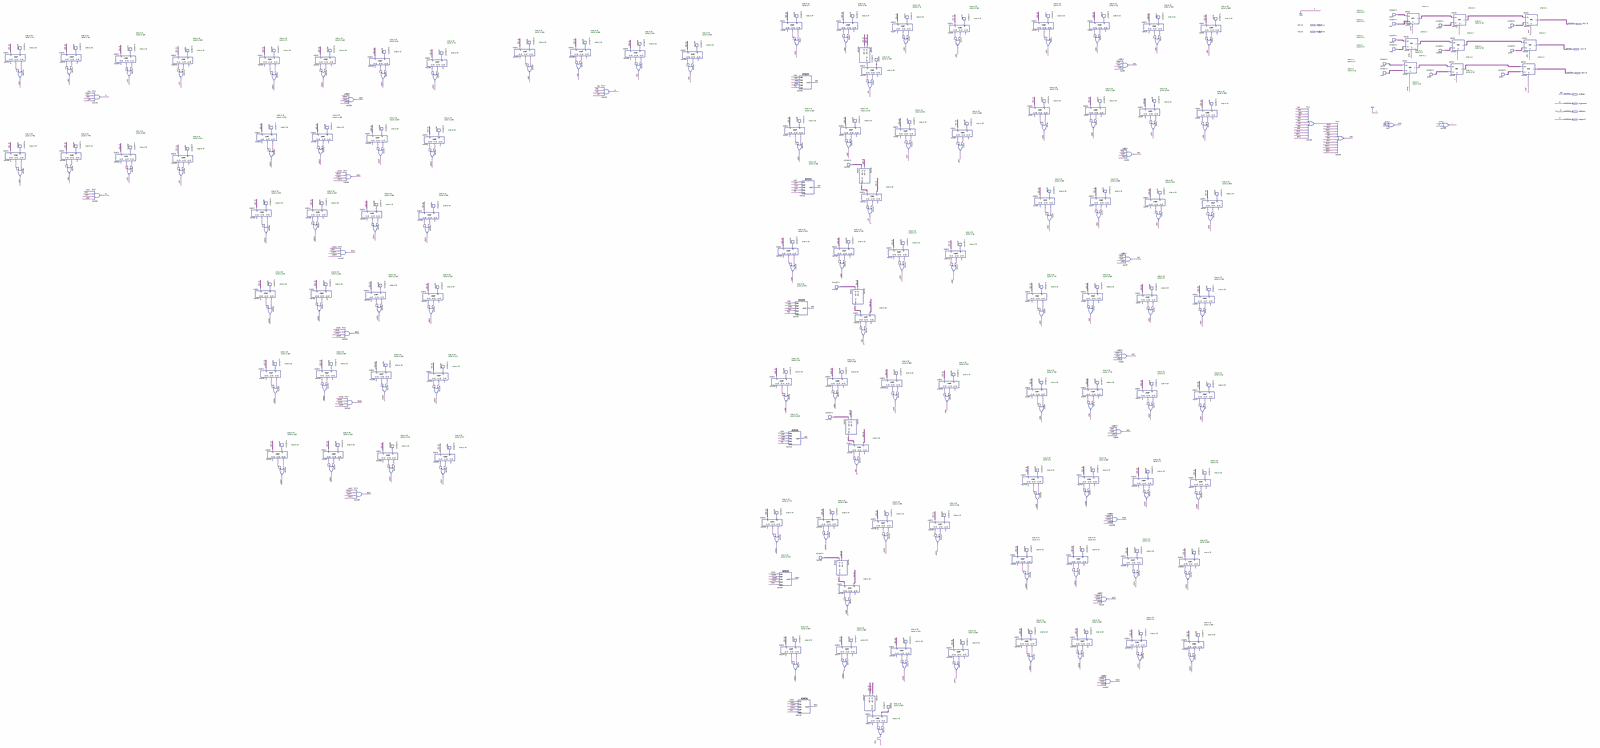
[diagram p0: schematic sheet, whole]
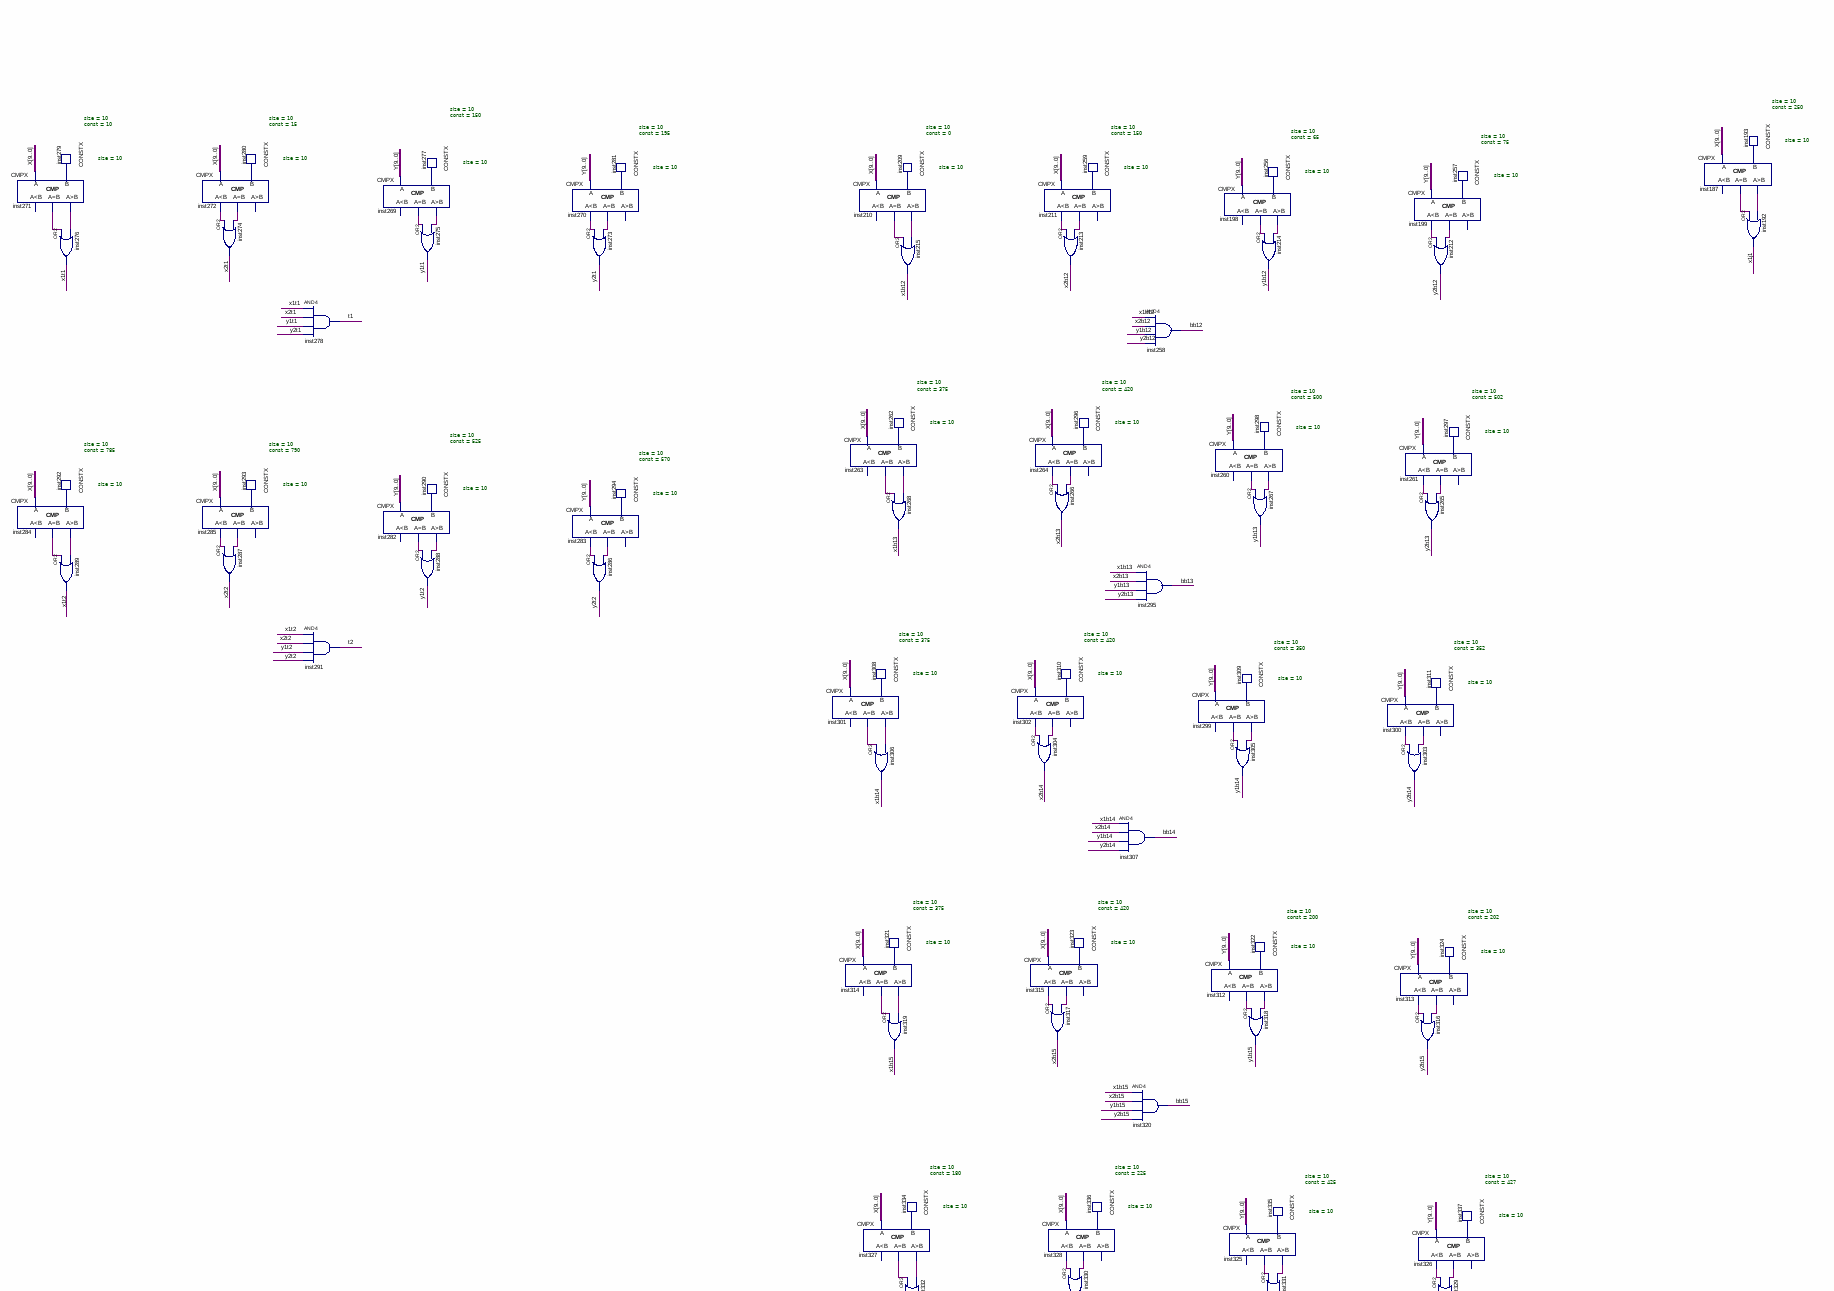
[diagram p1: schematic sheet, upper left part]
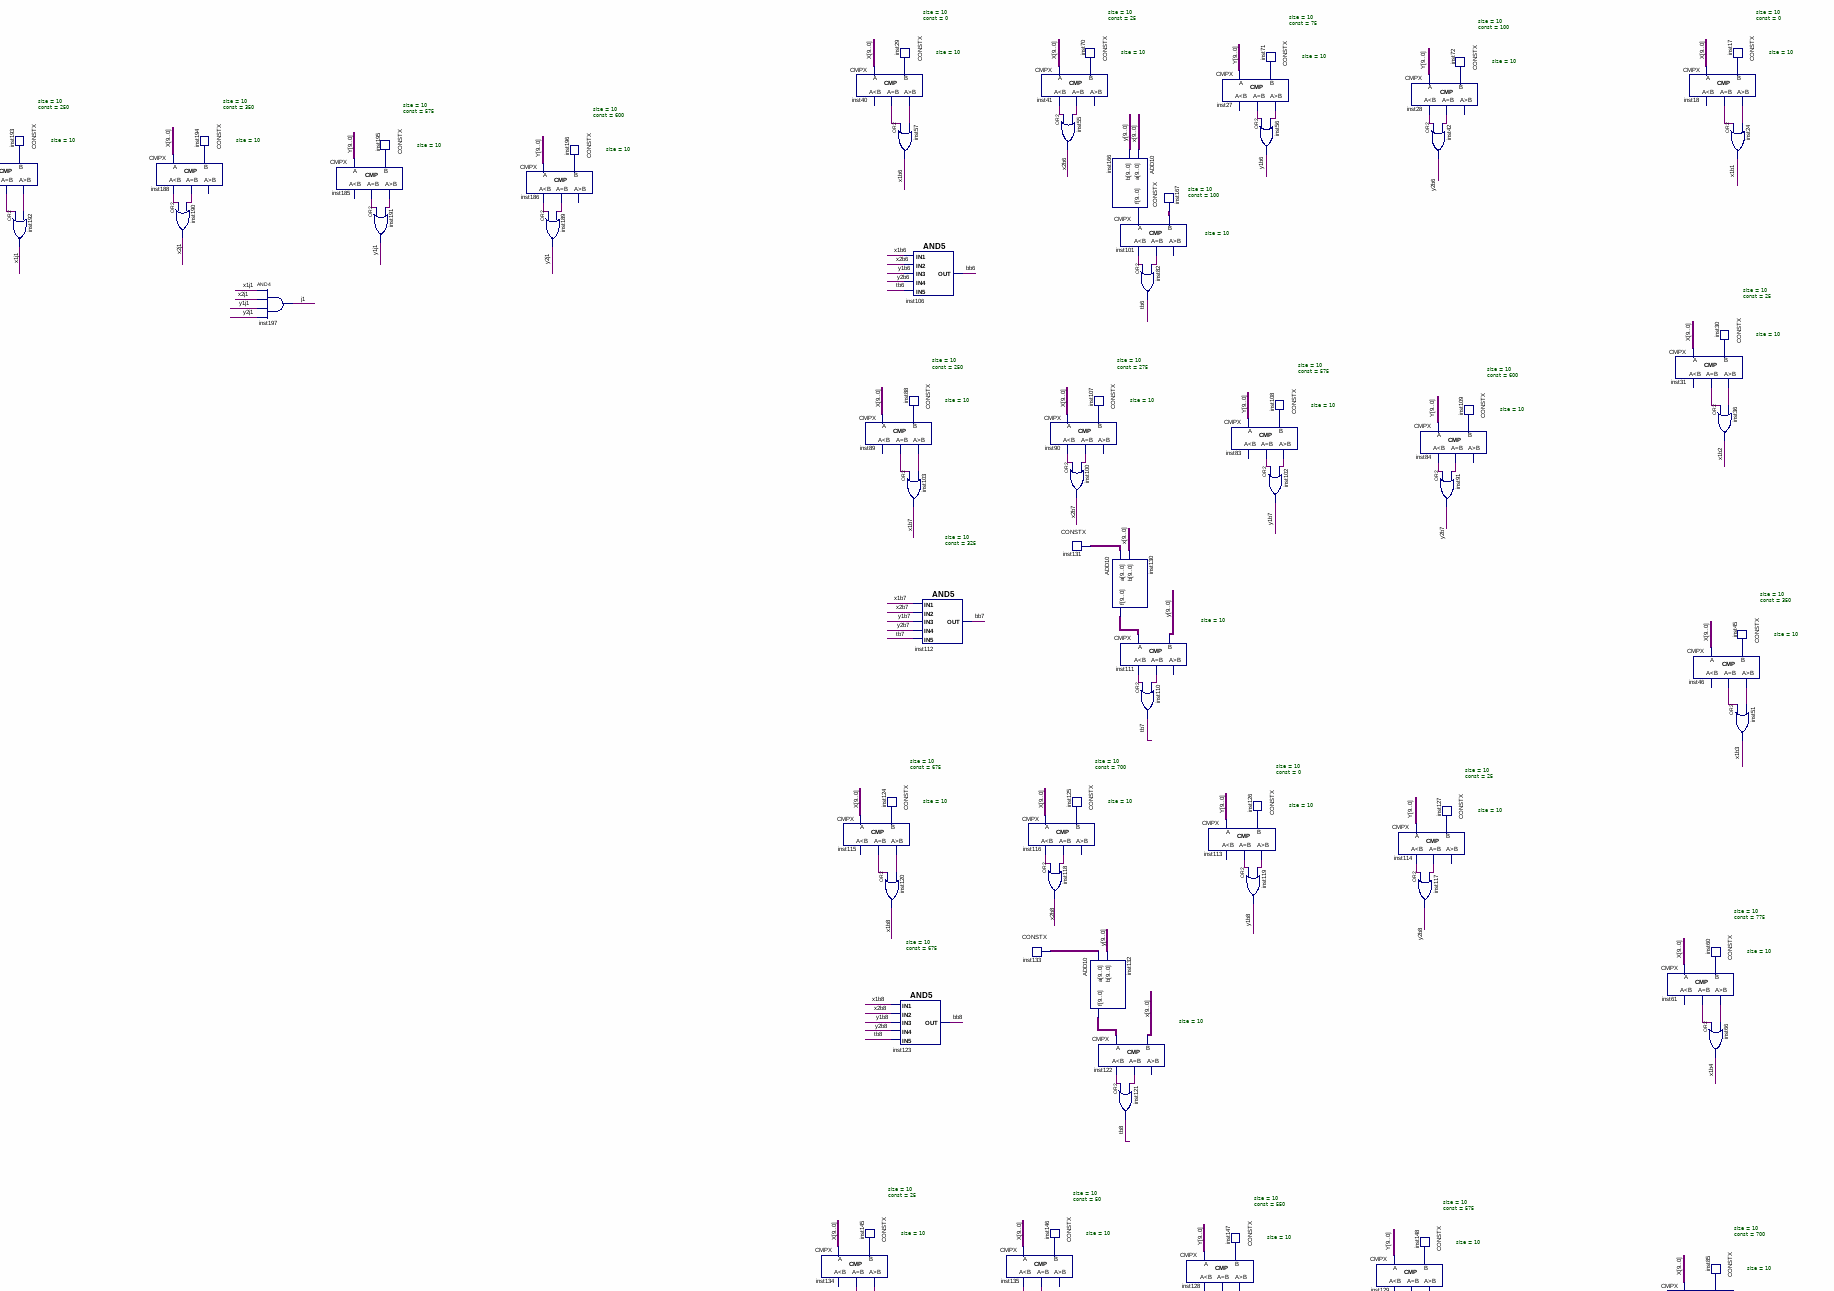
[diagram p2: schematic sheet, upper centre part]
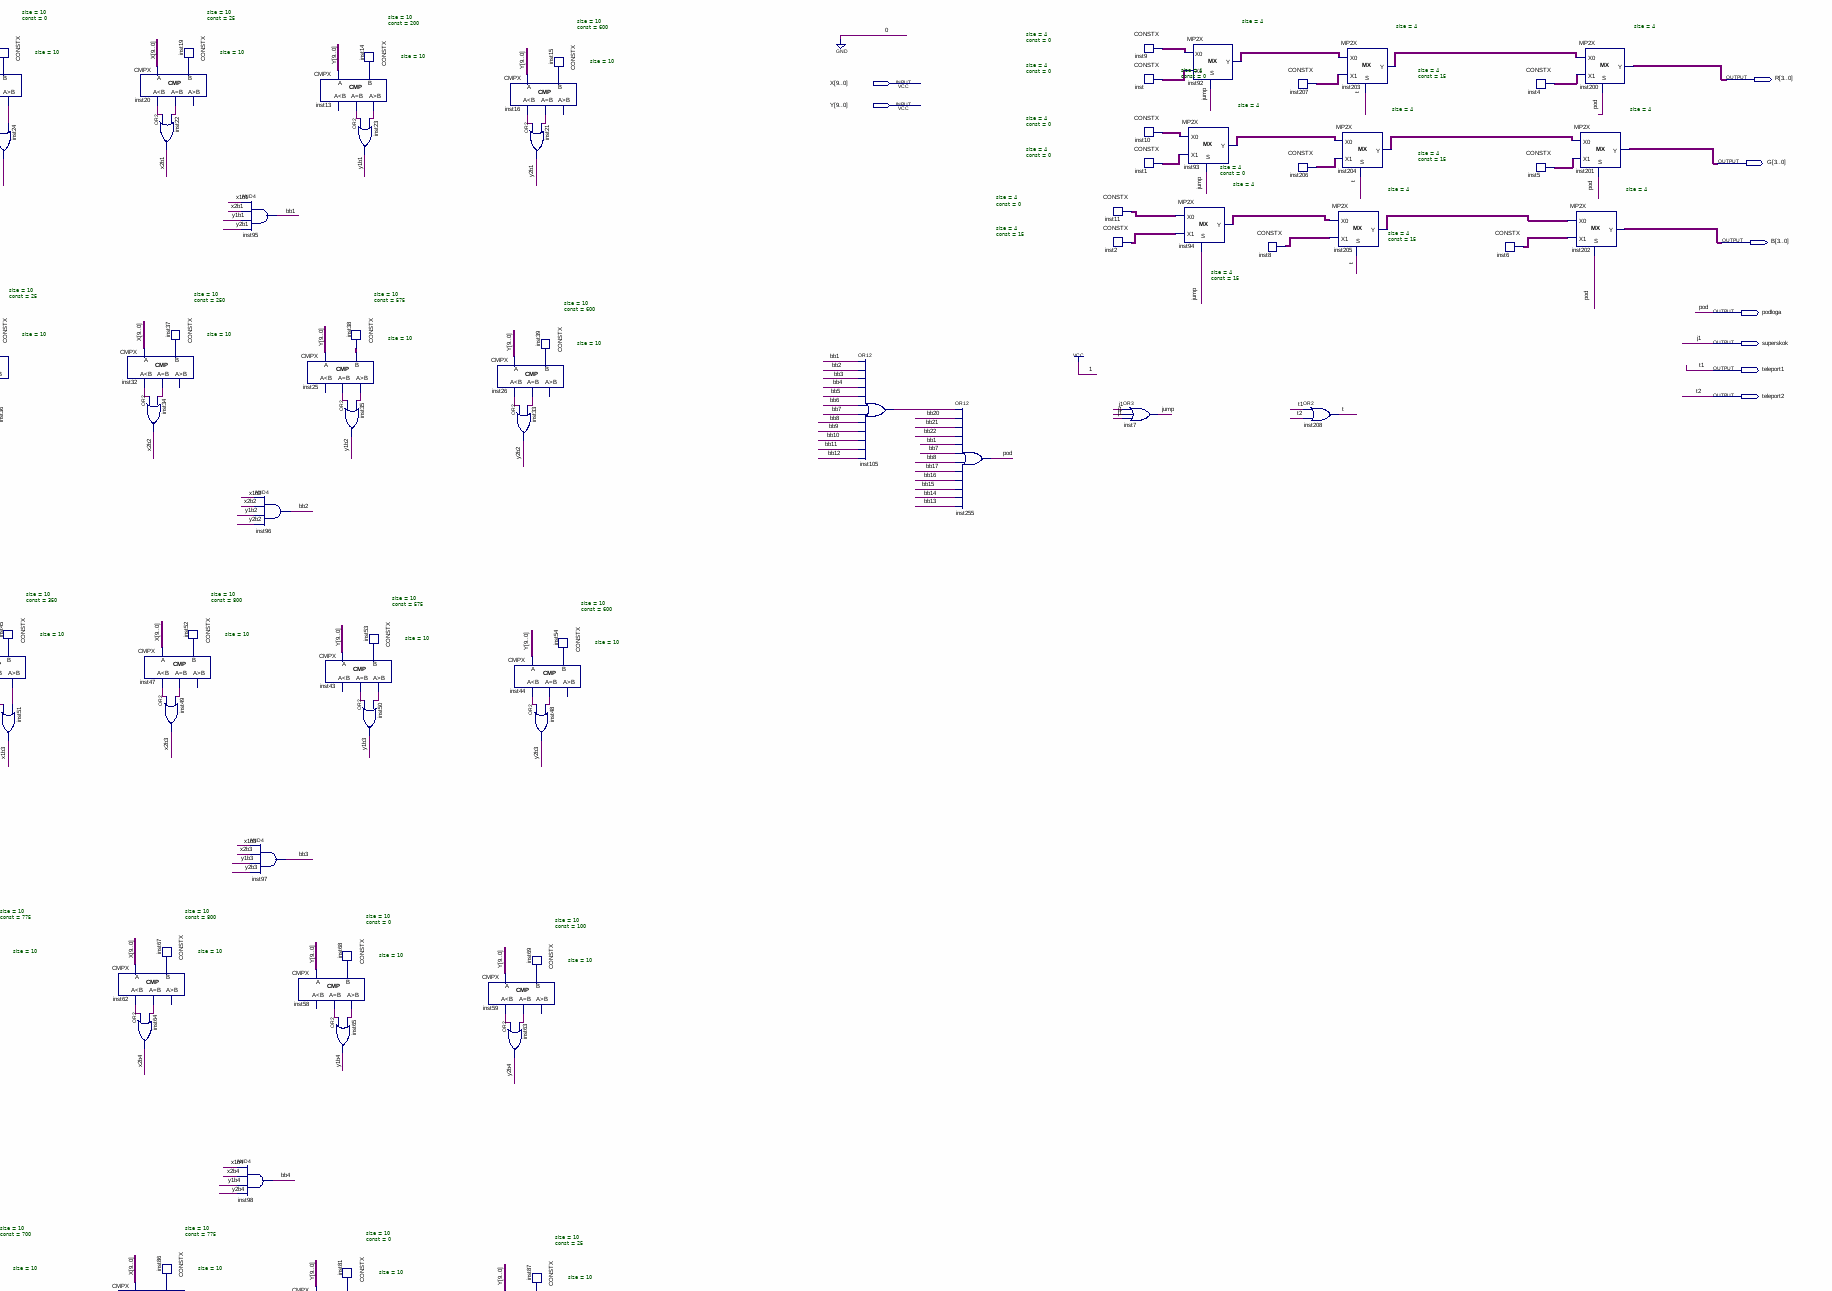
[diagram p3: schematic sheet, upper right part]
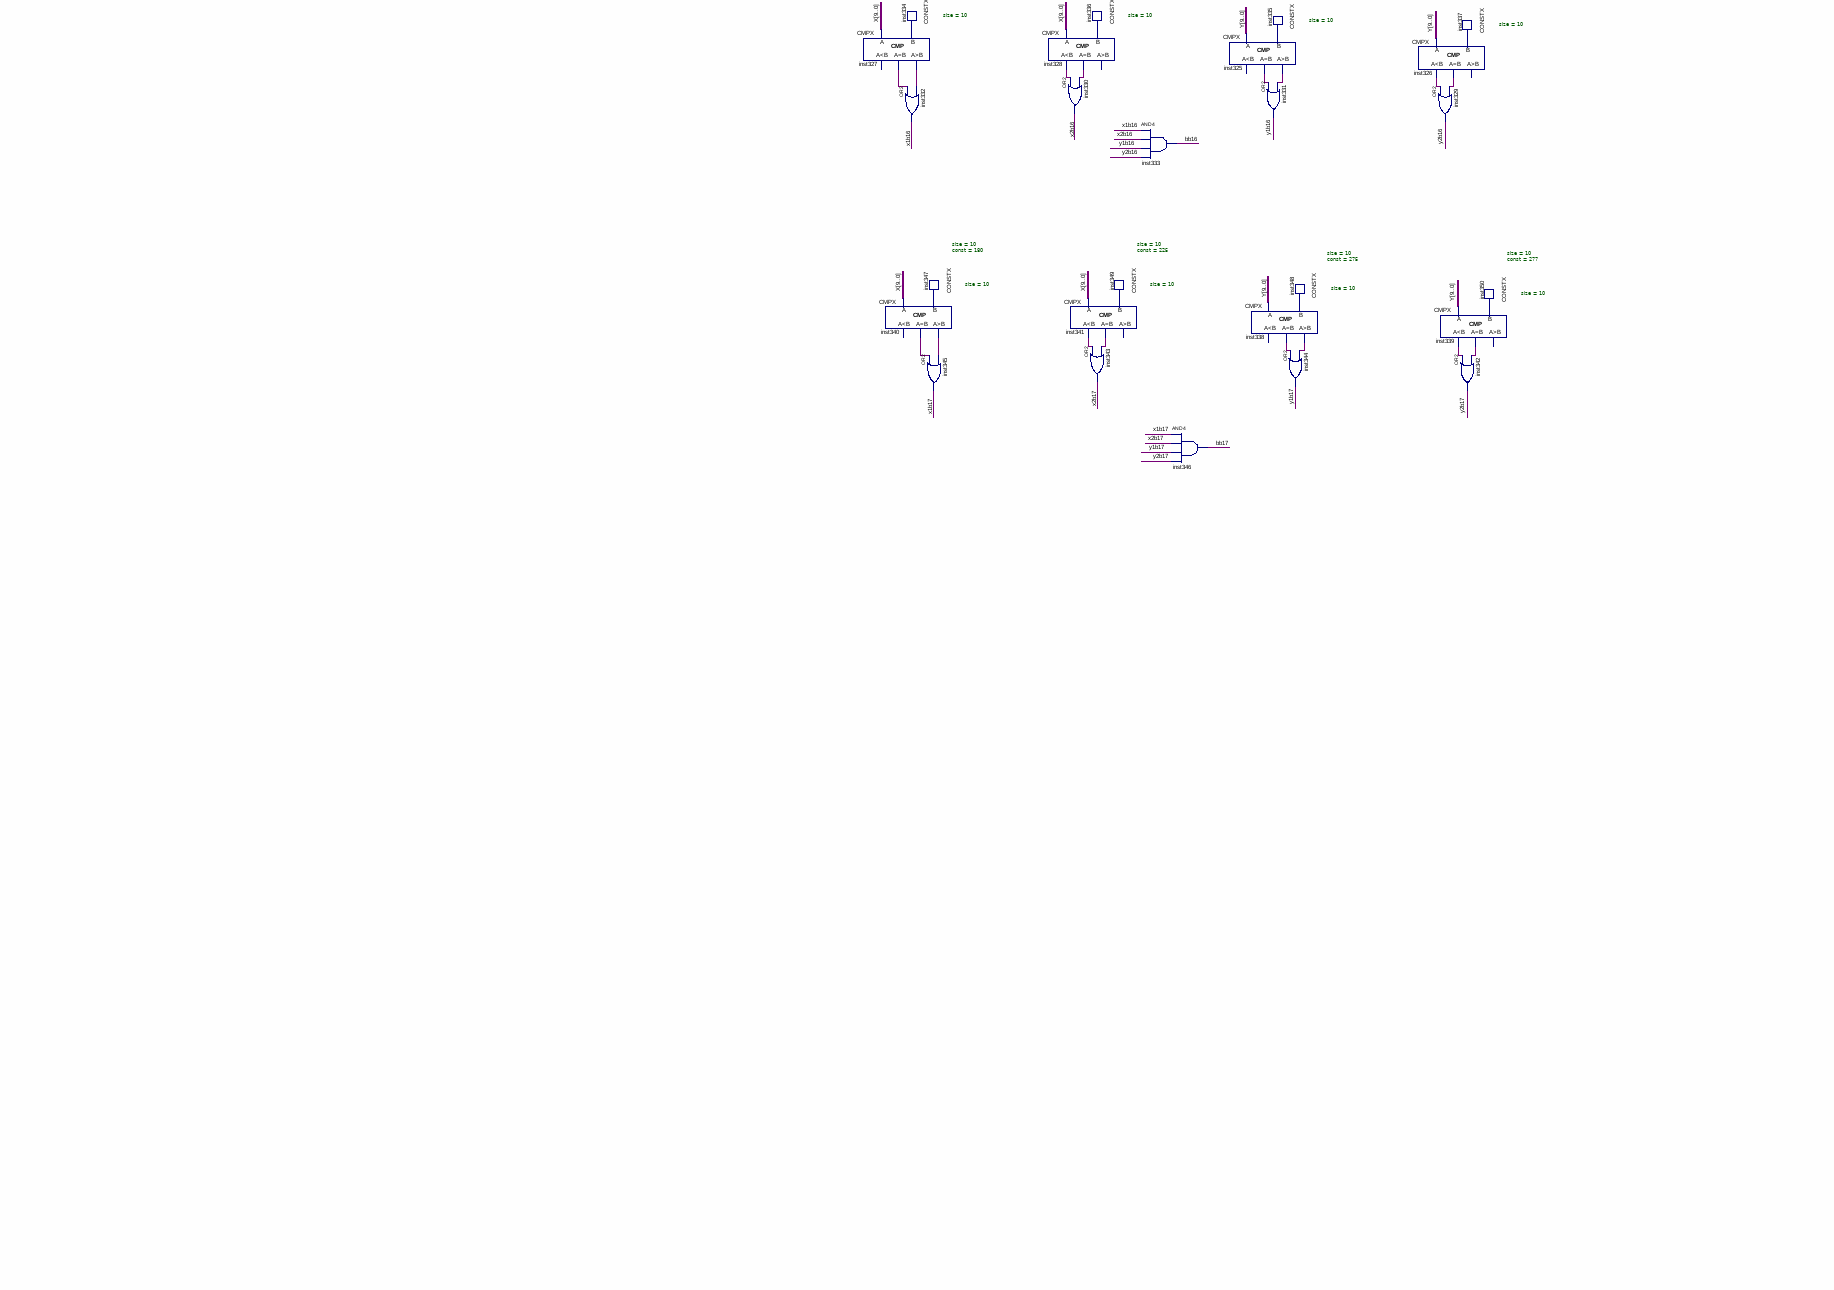
[diagram p4: schematic sheet, lower left part]
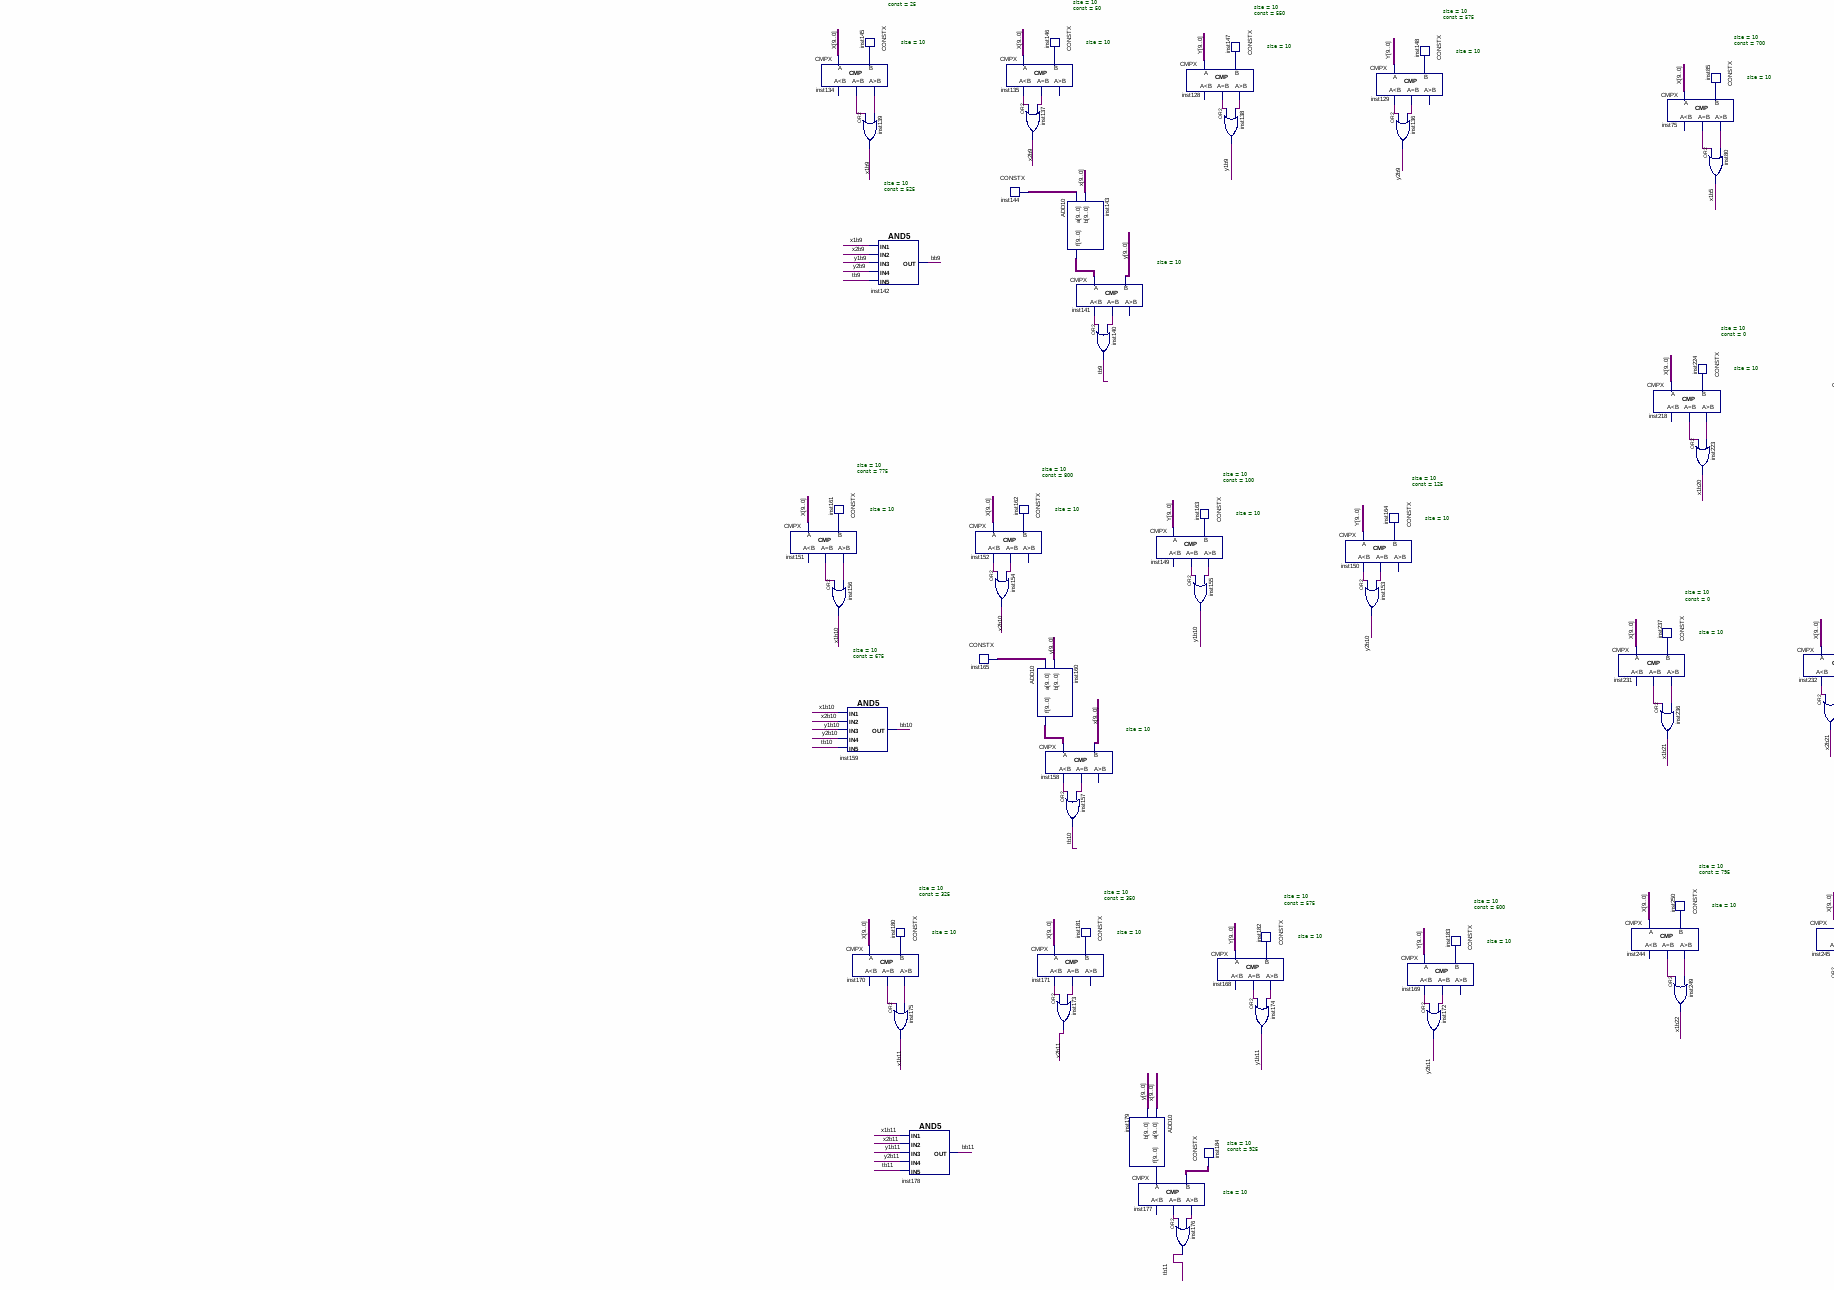
[diagram p5: schematic sheet, lower centre part]
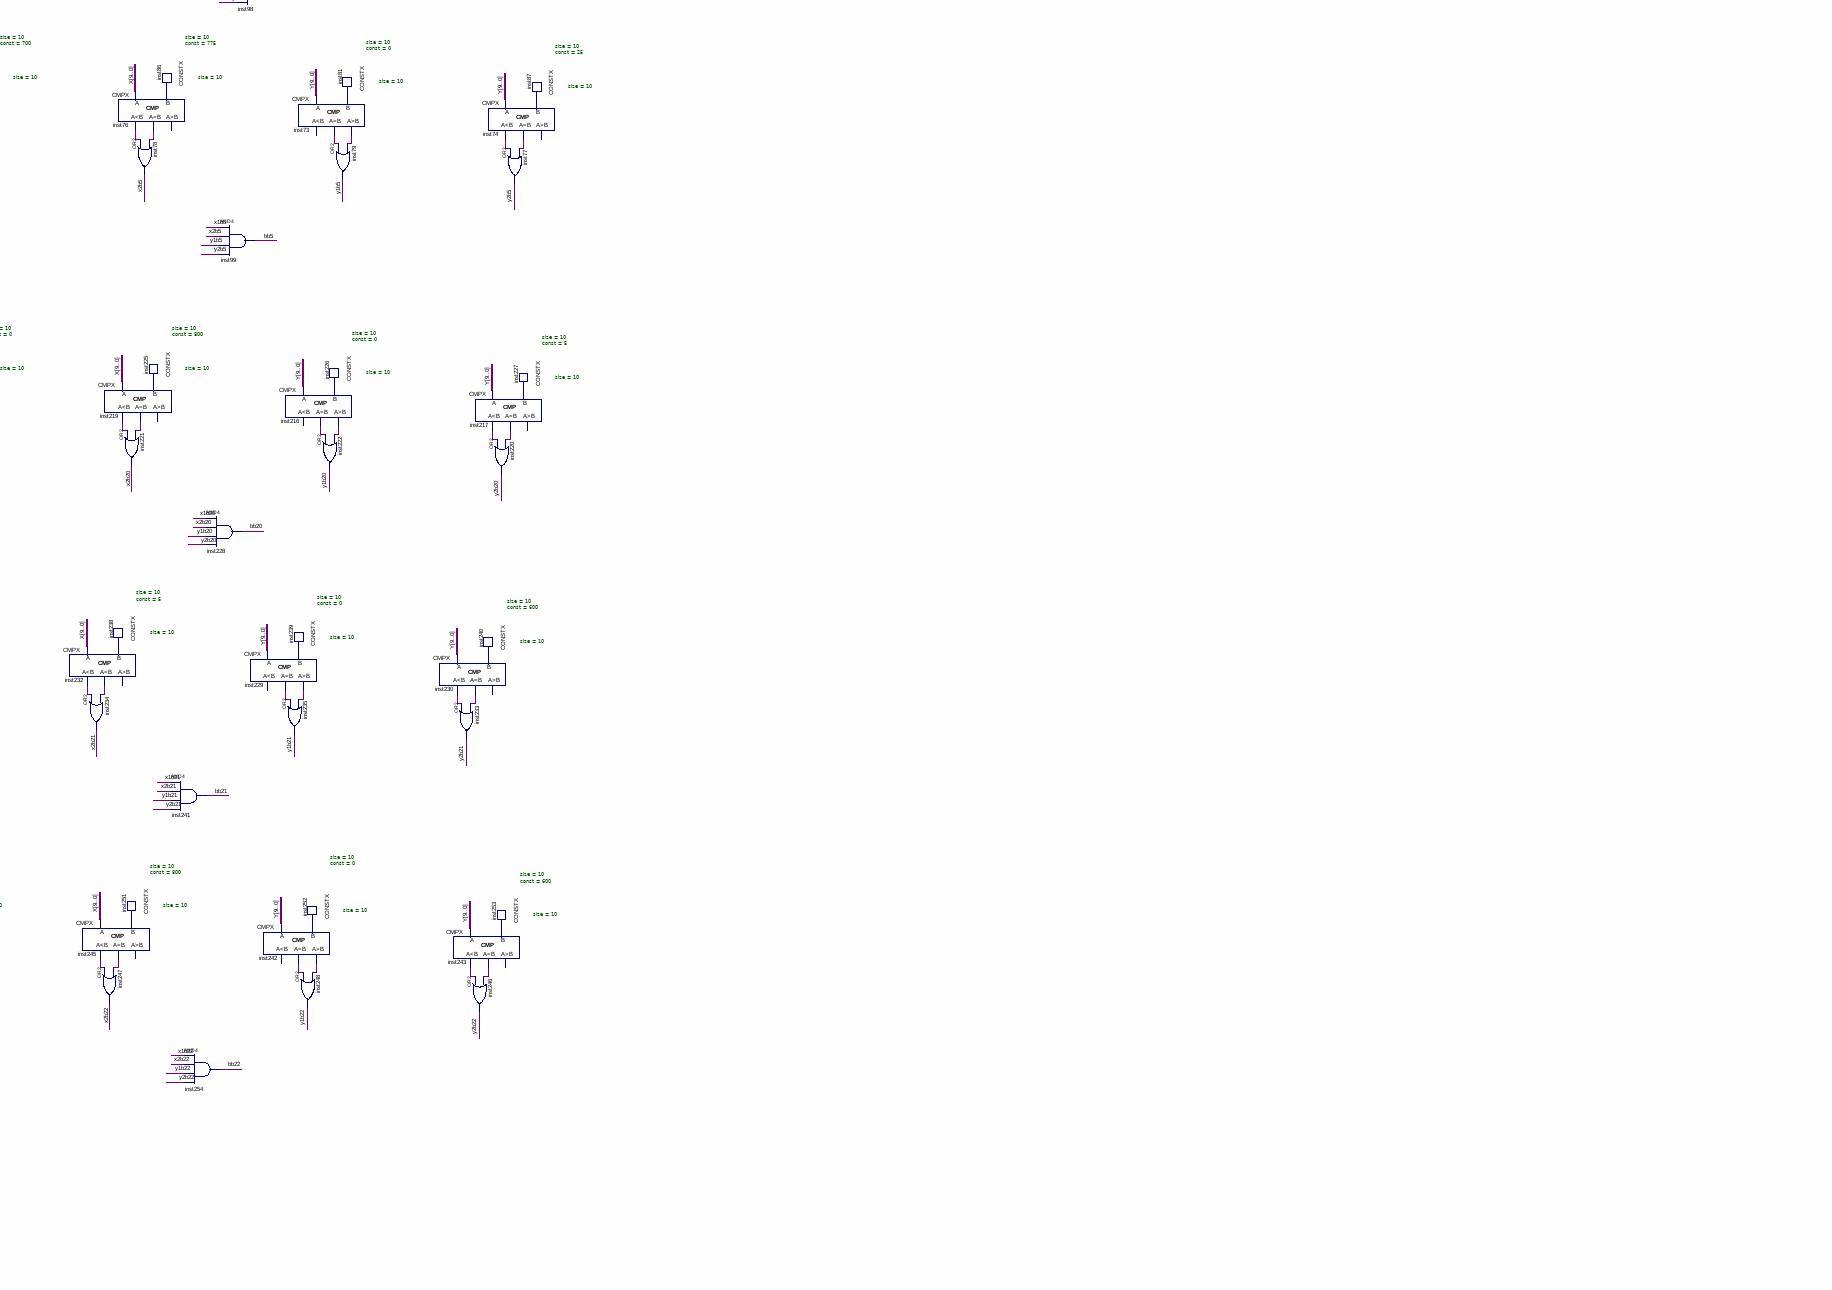
[diagram p6: schematic sheet, lower right part]
// Quartus schematic Layer0.bdf as structural Verilog: 348 symbols, 9 pins
module Layer0 (
  input  [9:0] X,
  input  [9:0] Y,
  output [3:0] R,
  output [3:0] G,
  output [3:0] B,
  output podloga,
  output superskok,
  output teleport1,
  output teleport2
);

  wire bb1, bb2, bb3, bb4, bb5, bb6, bb7, bb8, bb9, bb10, bb11, bb12, bb13, bb14, bb15, bb16, bb17, bb20,
       bb21, bb22, inst13_eq, inst13_gr, inst16_eq, inst16_ls, inst18_eq, inst18_gr, inst20_eq, inst20_ls,
       inst25_eq, inst25_gr, inst26_eq, inst26_ls, inst27_eq, inst27_gr, inst28_eq, inst28_ls, inst31_eq,
       inst31_gr, inst32_eq, inst32_ls, inst40_eq, inst40_gr, inst41_eq, inst41_ls, inst43_eq, inst43_gr,
       inst44_eq, inst44_ls, inst46_eq, inst46_gr, inst47_eq, inst47_ls, inst58_eq, inst58_gr, inst59_eq,
       inst59_ls, inst61_eq, inst61_gr, inst62_eq, inst62_ls, inst73_eq, inst73_gr, inst74_eq, inst74_ls,
       inst75_eq, inst75_gr, inst76_eq, inst76_ls, inst83_eq, inst83_gr, inst84_eq, inst84_ls, inst89_eq,
       inst89_gr, inst90_eq, inst90_ls, inst101_eq, inst101_ls, inst105_out, inst111_eq, inst111_ls,
       inst113_eq, inst113_gr, inst114_eq, inst114_ls, inst115_eq, inst115_gr, inst116_eq, inst116_ls,
       inst122_eq, inst122_ls, inst128_eq, inst128_gr, inst129_eq, inst129_ls, inst134_eq, inst134_gr,
       inst135_eq, inst135_ls, inst141_eq, inst141_ls, inst149_eq, inst149_gr, inst150_eq, inst150_ls,
       inst151_eq, inst151_gr, inst152_eq, inst152_ls, inst158_eq, inst158_ls, inst168_eq, inst168_gr,
       inst169_eq, inst169_ls, inst170_eq, inst170_gr, inst171_eq, inst171_ls, inst177_eq, inst177_gr,
       inst185_eq, inst185_gr, inst186_eq, inst186_ls, inst187_eq, inst187_gr, inst188_eq, inst188_ls,
       inst198_eq, inst198_gr, inst199_eq, inst199_ls, inst210_eq, inst210_gr, inst211_eq, inst211_ls,
       inst216_eq, inst216_gr, inst217_eq, inst217_ls, inst218_eq, inst218_gr, inst219_eq, inst219_ls,
       inst229_eq, inst229_gr, inst230_eq, inst230_ls, inst231_eq, inst231_gr, inst232_eq, inst232_ls,
       inst242_eq, inst242_gr, inst243_eq, inst243_ls, inst244_eq, inst244_gr, inst245_eq, inst245_ls,
       inst260_eq, inst260_gr, inst261_eq, inst261_ls, inst263_eq, inst263_gr, inst264_eq, inst264_ls,
       inst269_eq, inst269_gr, inst270_eq, inst270_ls, inst271_eq, inst271_gr, inst272_eq, inst272_ls,
       inst282_eq, inst282_gr, inst283_eq, inst283_ls, inst284_eq, inst284_gr, inst285_eq, inst285_ls,
       inst299_eq, inst299_gr, inst300_eq, inst300_ls, inst301_eq, inst301_gr, inst302_eq, inst302_ls,
       inst312_eq, inst312_gr, inst313_eq, inst313_ls, inst314_eq, inst314_gr, inst315_eq, inst315_ls,
       inst325_eq, inst325_gr, inst326_eq, inst326_ls, inst327_eq, inst327_gr, inst328_eq, inst328_ls,
       inst338_eq, inst338_gr, inst339_eq, inst339_ls, inst340_eq, inst340_gr, inst341_eq, inst341_ls, jump,
       t, tb6, tb7, tb8, tb9, tb10, tb11, x1b1, x1b2, x1b3, x1b4, x1b5, x1b6, x1b7, x1b8, x1b9, x1b10, x1b11,
       x1b12, x1b13, x1b14, x1b15, x1b16, x1b17, x1b20, x1b21, x1b22, x1j1, x1t1, x1t2, x2b1, x2b2, x2b3,
       x2b4, x2b5, x2b6, x2b7, x2b8, x2b9, x2b10, x2b11, x2b12, x2b13, x2b14, x2b15, x2b16, x2b17, x2b20,
       x2b21, x2b22, x2j1, x2t1, x2t2, y1b1, y1b2, y1b3, y1b4, y1b5, y1b6, y1b7, y1b8, y1b9, y1b10, y1b11,
       y1b12, y1b13, y1b14, y1b15, y1b16, y1b17, y1b20, y1b21, y1b22, y1j1, y1t1, y1t2, y2b1, y2b2, y2b3,
       y2b4, y2b5, y2b6, y2b7, y2b8, y2b9, y2b10, y2b11, y2b12, y2b13, y2b14, y2b15, y2b16, y2b17, y2b20,
       y2b21, y2b22, y2j1, y2t1, y2t2;
  wire [3:0] inst1_data, inst2_data, inst4_data, inst5_data, inst6_data, inst8_data, inst9_data, inst10_data,
       inst11_data, inst92_y, inst93_y, inst94_y, inst203_y, inst204_y, inst205_y, inst206_data,
       inst207_data, inst_data;
  wire [9:0] inst14_data, inst15_data, inst17_data, inst19_data, inst29_data, inst30_data, inst37_data,
       inst38_data, inst39_data, inst45_data, inst52_data, inst53_data, inst54_data, inst60_data,
       inst67_data, inst68_data, inst69_data, inst70_data, inst71_data, inst72_data, inst81_data,
       inst85_data, inst86_data, inst87_data, inst88_data, inst107_data, inst108_data, inst109_data,
       inst124_data, inst125_data, inst126_data, inst127_data, inst130_f, inst131_data, inst132_f,
       inst133_data, inst143_f, inst144_data, inst145_data, inst146_data, inst147_data, inst148_data,
       inst160_f, inst161_data, inst162_data, inst163_data, inst164_data, inst165_data, inst166_f,
       inst167_data, inst179_f, inst180_data, inst181_data, inst182_data, inst183_data, inst184_data,
       inst193_data, inst194_data, inst195_data, inst196_data, inst209_data, inst224_data, inst225_data,
       inst226_data, inst227_data, inst237_data, inst238_data, inst239_data, inst240_data, inst250_data,
       inst251_data, inst252_data, inst253_data, inst256_data, inst257_data, inst259_data, inst262_data,
       inst277_data, inst279_data, inst280_data, inst281_data, inst290_data, inst292_data, inst293_data,
       inst294_data, inst296_data, inst297_data, inst298_data, inst308_data, inst309_data, inst310_data,
       inst311_data, inst321_data, inst322_data, inst323_data, inst324_data, inst334_data, inst335_data,
       inst336_data, inst337_data, inst347_data, inst348_data, inst349_data, inst350_data;

  CMPX #(.size(10)) inst271 (.A(X), .B(inst279_data), .eq(inst271_eq), .gr(inst271_gr));  // open: ls
  CMPX #(.size(10)) inst284 (.A(X), .B(inst292_data), .eq(inst284_eq), .gr(inst284_gr));  // open: ls
  CONSTX #(.size(10), .\const (10)) inst279 (.data(inst279_data));
  or inst276 (x1t1, inst271_eq, inst271_gr);
  CONSTX #(.size(10), .\const (785)) inst292 (.data(inst292_data));
  or inst289 (x1t2, inst284_eq, inst284_gr);
  CMPX #(.size(10)) inst272 (.A(X), .B(inst280_data), .ls(inst272_ls), .eq(inst272_eq));  // open: gr
  CMPX #(.size(10)) inst285 (.A(X), .B(inst293_data), .ls(inst285_ls), .eq(inst285_eq));  // open: gr
  CONSTX #(.size(10), .\const (15)) inst280 (.data(inst280_data));
  or inst274 (x2t1, inst272_ls, inst272_eq);
  CONSTX #(.size(10), .\const (790)) inst293 (.data(inst293_data));
  or inst287 (x2t2, inst285_ls, inst285_eq);
  and inst278 (teleport1, x1t1, x2t1, y1t1, y2t1);
  and inst291 (teleport2, x1t2, x2t2, y1t2, y2t2);
  CMPX #(.size(10)) inst269 (.A(Y), .B(inst277_data), .eq(inst269_eq), .gr(inst269_gr));  // open: ls
  CMPX #(.size(10)) inst282 (.A(Y), .B(inst290_data), .eq(inst282_eq), .gr(inst282_gr));  // open: ls
  CONSTX #(.size(10), .\const (150)) inst277 (.data(inst277_data));
  or inst275 (y1t1, inst269_eq, inst269_gr);
  CONSTX #(.size(10), .\const (525)) inst290 (.data(inst290_data));
  or inst288 (y1t2, inst282_eq, inst282_gr);
  CMPX #(.size(10)) inst270 (.A(Y), .B(inst281_data), .ls(inst270_ls), .eq(inst270_eq));  // open: gr
  or inst273 (y2t1, inst270_ls, inst270_eq);
  CMPX #(.size(10)) inst283 (.A(Y), .B(inst294_data), .ls(inst283_ls), .eq(inst283_eq));  // open: gr
  or inst286 (y2t2, inst283_ls, inst283_eq);
  CONSTX #(.size(10), .\const (195)) inst281 (.data(inst281_data));
  CONSTX #(.size(10), .\const (570)) inst294 (.data(inst294_data));
  CMPX #(.size(10)) inst263 (.A(X), .B(inst262_data), .eq(inst263_eq), .gr(inst263_gr));  // open: ls
  CMPX #(.size(10)) inst301 (.A(X), .B(inst308_data), .eq(inst301_eq), .gr(inst301_gr));  // open: ls
  CMPX #(.size(10)) inst314 (.A(X), .B(inst321_data), .eq(inst314_eq), .gr(inst314_gr));  // open: ls
  CMPX #(.size(10)) inst210 (.A(X), .B(inst209_data), .eq(inst210_eq), .gr(inst210_gr));  // open: ls
  CONSTX #(.size(10), .\const (375)) inst308 (.data(inst308_data));
  or inst306 (x1b14, inst301_eq, inst301_gr);
  CMPX #(.size(10)) inst327 (.A(X), .B(inst334_data), .eq(inst327_eq), .gr(inst327_gr));  // open: ls
  CMPX #(.size(10)) inst340 (.A(X), .B(inst347_data), .eq(inst340_eq), .gr(inst340_gr));  // open: ls
  CONSTX #(.size(10), .\const (0)) inst209 (.data(inst209_data));
  or inst215 (x1b12, inst210_eq, inst210_gr);
  CONSTX #(.size(10), .\const (375)) inst262 (.data(inst262_data));
  or inst268 (x1b13, inst263_eq, inst263_gr);
  CONSTX #(.size(10), .\const (375)) inst321 (.data(inst321_data));
  or inst319 (x1b15, inst314_eq, inst314_gr);
  CONSTX #(.size(10), .\const (180)) inst334 (.data(inst334_data));
  or inst332 (x1b16, inst327_eq, inst327_gr);
  CONSTX #(.size(10), .\const (180)) inst347 (.data(inst347_data));
  or inst345 (x1b17, inst340_eq, inst340_gr);
  CMPX #(.size(10)) inst302 (.A(X), .B(inst310_data), .ls(inst302_ls), .eq(inst302_eq));  // open: gr
  CMPX #(.size(10)) inst211 (.A(X), .B(inst259_data), .ls(inst211_ls), .eq(inst211_eq));  // open: gr
  CMPX #(.size(10)) inst264 (.A(X), .B(inst296_data), .ls(inst264_ls), .eq(inst264_eq));  // open: gr
  or inst266 (x2b13, inst264_ls, inst264_eq);
  CONSTX #(.size(10), .\const (420)) inst310 (.data(inst310_data));
  or inst304 (x2b14, inst302_ls, inst302_eq);
  CMPX #(.size(10)) inst315 (.A(X), .B(inst323_data), .ls(inst315_ls), .eq(inst315_eq));  // open: gr
  or inst317 (x2b15, inst315_ls, inst315_eq);
  CMPX #(.size(10)) inst328 (.A(X), .B(inst336_data), .ls(inst328_ls), .eq(inst328_eq));  // open: gr
  CONSTX #(.size(10), .\const (150)) inst259 (.data(inst259_data));
  or inst213 (x2b12, inst211_ls, inst211_eq);
  CONSTX #(.size(10), .\const (420)) inst296 (.data(inst296_data));
  CONSTX #(.size(10), .\const (420)) inst323 (.data(inst323_data));
  CONSTX #(.size(10), .\const (225)) inst336 (.data(inst336_data));
  or inst330 (x2b16, inst328_ls, inst328_eq);
  CMPX #(.size(10)) inst341 (.A(X), .B(inst349_data), .ls(inst341_ls), .eq(inst341_eq));  // open: gr
  or inst343 (x2b17, inst341_ls, inst341_eq);
  and inst307 (bb14, x1b14, x2b14, y1b14, y2b14);
  CONSTX #(.size(10), .\const (225)) inst349 (.data(inst349_data));
  and inst258 (bb12, x1b12, x2b12, y1b12, y2b12);
  and inst295 (bb13, x1b13, x2b13, y1b13, y2b13);
  and inst320 (bb15, x1b15, x2b15, y1b15, y2b15);
  and inst333 (bb16, x1b16, x2b16, y1b16, y2b16);
  CMPX #(.size(10)) inst299 (.A(Y), .B(inst309_data), .eq(inst299_eq), .gr(inst299_gr));  // open: ls
  and inst346 (bb17, x1b17, x2b17, y1b17, y2b17);
  CMPX #(.size(10)) inst198 (.A(Y), .B(inst256_data), .eq(inst198_eq), .gr(inst198_gr));  // open: ls
  CMPX #(.size(10)) inst260 (.A(Y), .B(inst298_data), .eq(inst260_eq), .gr(inst260_gr));  // open: ls
  or inst305 (y1b14, inst299_eq, inst299_gr);
  CMPX #(.size(10)) inst312 (.A(Y), .B(inst322_data), .eq(inst312_eq), .gr(inst312_gr));  // open: ls
  CMPX #(.size(10)) inst325 (.A(Y), .B(inst335_data), .eq(inst325_eq), .gr(inst325_gr));  // open: ls
  CONSTX #(.size(10), .\const (65)) inst256 (.data(inst256_data));
  or inst214 (y1b12, inst198_eq, inst198_gr);
  CONSTX #(.size(10), .\const (500)) inst298 (.data(inst298_data));
  or inst267 (y1b13, inst260_eq, inst260_gr);
  CONSTX #(.size(10), .\const (350)) inst309 (.data(inst309_data));
  CONSTX #(.size(10), .\const (200)) inst322 (.data(inst322_data));
  or inst318 (y1b15, inst312_eq, inst312_gr);
  CONSTX #(.size(10), .\const (425)) inst335 (.data(inst335_data));
  or inst331 (y1b16, inst325_eq, inst325_gr);
  CMPX #(.size(10)) inst338 (.A(Y), .B(inst348_data), .eq(inst338_eq), .gr(inst338_gr));  // open: ls
  CONSTX #(.size(10), .\const (275)) inst348 (.data(inst348_data));
  or inst344 (y1b17, inst338_eq, inst338_gr);
  CMPX #(.size(10)) inst199 (.A(Y), .B(inst257_data), .ls(inst199_ls), .eq(inst199_eq));  // open: gr
  CMPX #(.size(10)) inst261 (.A(Y), .B(inst297_data), .ls(inst261_ls), .eq(inst261_eq));  // open: gr
  CMPX #(.size(10)) inst300 (.A(Y), .B(inst311_data), .ls(inst300_ls), .eq(inst300_eq));  // open: gr
  or inst303 (y2b14, inst300_ls, inst300_eq);
  CMPX #(.size(10)) inst313 (.A(Y), .B(inst324_data), .ls(inst313_ls), .eq(inst313_eq));  // open: gr
  or inst212 (y2b12, inst199_ls, inst199_eq);
  CONSTX #(.size(10), .\const (502)) inst297 (.data(inst297_data));
  or inst265 (y2b13, inst261_ls, inst261_eq);
  CONSTX #(.size(10), .\const (352)) inst311 (.data(inst311_data));
  CONSTX #(.size(10), .\const (202)) inst324 (.data(inst324_data));
  or inst316 (y2b15, inst313_ls, inst313_eq);
  CMPX #(.size(10)) inst326 (.A(Y), .B(inst337_data), .ls(inst326_ls), .eq(inst326_eq));  // open: gr
  or inst329 (y2b16, inst326_ls, inst326_eq);
  CMPX #(.size(10)) inst339 (.A(Y), .B(inst350_data), .ls(inst339_ls), .eq(inst339_eq));  // open: gr
  CONSTX #(.size(10), .\const (75)) inst257 (.data(inst257_data));
  CONSTX #(.size(10), .\const (427)) inst337 (.data(inst337_data));
  CONSTX #(.size(10), .\const (277)) inst350 (.data(inst350_data));
  or inst342 (y2b17, inst339_ls, inst339_eq);
  CMPX #(.size(10)) inst187 (.A(X), .B(inst193_data), .eq(inst187_eq), .gr(inst187_gr));  // open: ls
  CONSTX #(.size(10), .\const (250)) inst193 (.data(inst193_data));
  or inst192 (x1j1, inst187_eq, inst187_gr);
  CMPX #(.size(10)) inst188 (.A(X), .B(inst194_data), .ls(inst188_ls), .eq(inst188_eq));  // open: gr
  CONSTX #(.size(10), .\const (350)) inst194 (.data(inst194_data));
  or inst190 (x2j1, inst188_ls, inst188_eq);
  and inst197 (superskok, x1j1, x2j1, y1j1, y2j1);
  CMPX #(.size(10)) inst185 (.A(Y), .B(inst195_data), .eq(inst185_eq), .gr(inst185_gr));  // open: ls
  CONSTX #(.size(10), .\const (575)) inst195 (.data(inst195_data));
  or inst191 (y1j1, inst185_eq, inst185_gr);
  CMPX #(.size(10)) inst186 (.A(Y), .B(inst196_data), .ls(inst186_ls), .eq(inst186_eq));  // open: gr
  or inst189 (y2j1, inst186_ls, inst186_eq);
  CONSTX #(.size(10), .\const (600)) inst196 (.data(inst196_data));
  CMPX #(.size(10)) inst151 (.A(X), .B(inst161_data), .eq(inst151_eq), .gr(inst151_gr));  // open: ls
  CMPX #(.size(10)) inst115 (.A(X), .B(inst124_data), .eq(inst115_eq), .gr(inst115_gr));  // open: ls
  CMPX #(.size(10)) inst134 (.A(X), .B(inst145_data), .eq(inst134_eq), .gr(inst134_gr));  // open: ls
  CONSTX #(.size(10), .\const (775)) inst161 (.data(inst161_data));
  or inst156 (x1b10, inst151_eq, inst151_gr);
  CMPX #(.size(10)) inst40 (.A(X), .B(inst29_data), .eq(inst40_eq), .gr(inst40_gr));  // open: ls
  CMPX #(.size(10)) inst89 (.A(X), .B(inst88_data), .eq(inst89_eq), .gr(inst89_gr));  // open: ls
  CONSTX #(.size(10), .\const (25)) inst145 (.data(inst145_data));
  or inst139 (x1b9, inst134_eq, inst134_gr);
  and inst142 (bb9, x1b9, x2b9, y1b9, y2b9, tb9);
  and inst159 (bb10, x1b10, x2b10, y1b10, y2b10, tb10);
  CMPX #(.size(10)) inst170 (.A(X), .B(inst180_data), .eq(inst170_eq), .gr(inst170_gr));  // open: ls
  CONSTX #(.size(10), .\const (0)) inst29 (.data(inst29_data));
  or inst57 (x1b6, inst40_eq, inst40_gr);
  and inst106 (bb6, x1b6, x2b6, y1b6, y2b6, tb6);
  CONSTX #(.size(10), .\const (250)) inst88 (.data(inst88_data));
  or inst103 (x1b7, inst89_eq, inst89_gr);
  CONSTX #(.size(10), .\const (675)) inst124 (.data(inst124_data));
  or inst120 (x1b8, inst115_eq, inst115_gr);
  and inst123 (bb8, x1b8, x2b8, y1b8, y2b8, tb8);
  CONSTX #(.size(10), .\const (325)) inst180 (.data(inst180_data));
  or inst175 (x1b11, inst170_eq, inst170_gr);
  and inst178 (bb11, x1b11, x2b11, y1b11, y2b11, tb11);
  and inst112 (bb7, x1b7, x2b7, y1b7, y2b7, tb7);
  CMPX #(.size(10)) inst152 (.A(X), .B(inst162_data), .ls(inst152_ls), .eq(inst152_eq));  // open: gr
  CONSTX #(.size(10), .\const (675)) inst165 (.data(inst165_data));
  CMPX #(.size(10)) inst135 (.A(X), .B(inst146_data), .ls(inst135_ls), .eq(inst135_eq));  // open: gr
  CONSTX #(.size(10), .\const (525)) inst144 (.data(inst144_data));
  CONSTX #(.size(10), .\const (800)) inst162 (.data(inst162_data));
  or inst154 (x2b10, inst152_ls, inst152_eq);
  CMPX #(.size(10)) inst41 (.A(X), .B(inst70_data), .ls(inst41_ls), .eq(inst41_eq));  // open: gr
  CMPX #(.size(10)) inst90 (.A(X), .B(inst107_data), .ls(inst90_ls), .eq(inst90_eq));  // open: gr
  CMPX #(.size(10)) inst116 (.A(X), .B(inst125_data), .ls(inst116_ls), .eq(inst116_eq));  // open: gr
  or inst118 (x2b8, inst116_ls, inst116_eq);
  CONSTX #(.size(10), .\const (675)) inst133 (.data(inst133_data));
  CONSTX #(.size(10), .\const (50)) inst146 (.data(inst146_data));
  or inst137 (x2b9, inst135_ls, inst135_eq);
  ADD10 inst160 (.a(inst165_data), .b(Y), .f(inst160_f));
  CMPX #(.size(10)) inst158 (.A(inst160_f), .B(X), .ls(inst158_ls), .eq(inst158_eq));  // open: gr
  CMPX #(.size(10)) inst171 (.A(X), .B(inst181_data), .ls(inst171_ls), .eq(inst171_eq));  // open: gr
  CONSTX #(.size(10), .\const (25)) inst70 (.data(inst70_data));
  or inst55 (x2b6, inst41_ls, inst41_eq);
  or inst100 (x2b7, inst90_ls, inst90_eq);
  CONSTX #(.size(10), .\const (325)) inst131 (.data(inst131_data));
  CONSTX #(.size(10), .\const (700)) inst125 (.data(inst125_data));
  ADD10 inst132 (.a(inst133_data), .b(Y), .f(inst132_f));
  ADD10 inst143 (.a(inst144_data), .b(X), .f(inst143_f));
  CMPX #(.size(10)) inst141 (.A(inst143_f), .B(Y), .ls(inst141_ls), .eq(inst141_eq));  // open: gr
  or inst157 (tb10, inst158_ls, inst158_eq);
  CONSTX #(.size(10), .\const (350)) inst181 (.data(inst181_data));
  or inst173 (x2b11, inst171_ls, inst171_eq);
  ADD10 inst166 (.a(X), .b(Y), .f(inst166_f));
  CMPX #(.size(10)) inst101 (.A(inst166_f), .B(inst167_data), .ls(inst101_ls), .eq(inst101_eq));  // open: gr
  CONSTX #(.size(10), .\const (275)) inst107 (.data(inst107_data));
  ADD10 inst130 (.a(inst131_data), .b(X), .f(inst130_f));
  CMPX #(.size(10)) inst111 (.A(inst130_f), .B(Y), .ls(inst111_ls), .eq(inst111_eq));  // open: gr
  CMPX #(.size(10)) inst122 (.A(inst132_f), .B(X), .ls(inst122_ls), .eq(inst122_eq));  // open: gr
  or inst121 (tb8, inst122_ls, inst122_eq);
  or inst140 (tb9, inst141_ls, inst141_eq);
  CONSTX #(.size(10), .\const (100)) inst167 (.data(inst167_data));
  or inst82 (tb6, inst101_ls, inst101_eq);
  or inst110 (tb7, inst111_ls, inst111_eq);
  CMPX #(.size(10)) inst149 (.A(Y), .B(inst163_data), .eq(inst149_eq), .gr(inst149_gr));  // open: ls
  ADD10 inst179 (.a(X), .b(Y), .f(inst179_f));
  CMPX #(.size(10)) inst177 (.A(inst179_f), .B(inst184_data), .eq(inst177_eq), .gr(inst177_gr));  // open: ls
  CMPX #(.size(10)) inst128 (.A(Y), .B(inst147_data), .eq(inst128_eq), .gr(inst128_gr));  // open: ls
  or inst155 (y1b10, inst149_eq, inst149_gr);
  or inst176 (tb11, inst177_eq, inst177_gr);
  CMPX #(.size(10)) inst27 (.A(Y), .B(inst71_data), .eq(inst27_eq), .gr(inst27_gr));  // open: ls
  CMPX #(.size(10)) inst83 (.A(Y), .B(inst108_data), .eq(inst83_eq), .gr(inst83_gr));  // open: ls
  CMPX #(.size(10)) inst113 (.A(Y), .B(inst126_data), .eq(inst113_eq), .gr(inst113_gr));  // open: ls
  CONSTX #(.size(10), .\const (550)) inst147 (.data(inst147_data));
  or inst138 (y1b9, inst128_eq, inst128_gr);
  CONSTX #(.size(10), .\const (100)) inst163 (.data(inst163_data));
  CMPX #(.size(10)) inst168 (.A(Y), .B(inst182_data), .eq(inst168_eq), .gr(inst168_gr));  // open: ls
  CONSTX #(.size(10), .\const (925)) inst184 (.data(inst184_data));
  CONSTX #(.size(10), .\const (75)) inst71 (.data(inst71_data));
  or inst56 (y1b6, inst27_eq, inst27_gr);
  CONSTX #(.size(10), .\const (0)) inst126 (.data(inst126_data));
  or inst119 (y1b8, inst113_eq, inst113_gr);
  CONSTX #(.size(10), .\const (575)) inst182 (.data(inst182_data));
  or inst174 (y1b11, inst168_eq, inst168_gr);
  CONSTX #(.size(10), .\const (575)) inst108 (.data(inst108_data));
  or inst102 (y1b7, inst83_eq, inst83_gr);
  CMPX #(.size(10)) inst150 (.A(Y), .B(inst164_data), .ls(inst150_ls), .eq(inst150_eq));  // open: gr
  or inst153 (y2b10, inst150_ls, inst150_eq);
  CMPX #(.size(10)) inst114 (.A(Y), .B(inst127_data), .ls(inst114_ls), .eq(inst114_eq));  // open: gr
  CMPX #(.size(10)) inst129 (.A(Y), .B(inst148_data), .ls(inst129_ls), .eq(inst129_eq));  // open: gr
  or inst136 (y2b9, inst129_ls, inst129_eq);
  CONSTX #(.size(10), .\const (125)) inst164 (.data(inst164_data));
  CMPX #(.size(10)) inst169 (.A(Y), .B(inst183_data), .ls(inst169_ls), .eq(inst169_eq));  // open: gr
  CMPX #(.size(10)) inst28 (.A(Y), .B(inst72_data), .ls(inst28_ls), .eq(inst28_eq));  // open: gr
  or inst42 (y2b6, inst28_ls, inst28_eq);
  CMPX #(.size(10)) inst84 (.A(Y), .B(inst109_data), .ls(inst84_ls), .eq(inst84_eq));  // open: gr
  or inst91 (y2b7, inst84_ls, inst84_eq);
  CONSTX #(.size(10), .\const (25)) inst127 (.data(inst127_data));
  or inst117 (y2b8, inst114_ls, inst114_eq);
  CONSTX #(.size(10), .\const (575)) inst148 (.data(inst148_data));
  or inst172 (y2b11, inst169_ls, inst169_eq);
  CONSTX #(.size(10), .\const (100)) inst72 (.data(inst72_data));
  CONSTX #(.size(10), .\const (600)) inst109 (.data(inst109_data));
  CONSTX #(.size(10), .\const (600)) inst183 (.data(inst183_data));
  CMPX #(.size(10)) inst231 (.A(X), .B(inst237_data), .eq(inst231_eq), .gr(inst231_gr));  // open: ls
  CMPX #(.size(10)) inst218 (.A(X), .B(inst224_data), .eq(inst218_eq), .gr(inst218_gr));  // open: ls
  CMPX #(.size(10)) inst244 (.A(X), .B(inst250_data), .eq(inst244_eq), .gr(inst244_gr));  // open: ls
  CMPX #(.size(10)) inst18 (.A(X), .B(inst17_data), .eq(inst18_eq), .gr(inst18_gr));  // open: ls
  CMPX #(.size(10)) inst31 (.A(X), .B(inst30_data), .eq(inst31_eq), .gr(inst31_gr));  // open: ls
  CMPX #(.size(10)) inst61 (.A(X), .B(inst60_data), .eq(inst61_eq), .gr(inst61_gr));  // open: ls
  CMPX #(.size(10)) inst75 (.A(X), .B(inst85_data), .eq(inst75_eq), .gr(inst75_gr));  // open: ls
  CONSTX #(.size(10), .\const (0)) inst237 (.data(inst237_data));
  or inst236 (x1b21, inst231_eq, inst231_gr);
  CONSTX #(.size(10), .\const (795)) inst250 (.data(inst250_data));
  or inst249 (x1b22, inst244_eq, inst244_gr);
  CONSTX #(.size(10), .\const (25)) inst30 (.data(inst30_data));
  or inst36 (x1b2, inst31_eq, inst31_gr);
  CMPX #(.size(10)) inst46 (.A(X), .B(inst45_data), .eq(inst46_eq), .gr(inst46_gr));  // open: ls
  CONSTX #(.size(10), .\const (775)) inst60 (.data(inst60_data));
  or inst66 (x1b4, inst61_eq, inst61_gr);
  CONSTX #(.size(10), .\const (700)) inst85 (.data(inst85_data));
  or inst80 (x1b5, inst75_eq, inst75_gr);
  CONSTX #(.size(10), .\const (0)) inst224 (.data(inst224_data));
  or inst223 (x1b20, inst218_eq, inst218_gr);
  CONSTX #(.size(10), .\const (0)) inst17 (.data(inst17_data));
  or inst24 (x1b1, inst18_eq, inst18_gr);
  CONSTX #(.size(10), .\const (350)) inst45 (.data(inst45_data));
  or inst51 (x1b3, inst46_eq, inst46_gr);
  CMPX #(.size(10)) inst232 (.A(X), .B(inst238_data), .ls(inst232_ls), .eq(inst232_eq));  // open: gr
  or inst234 (x2b21, inst232_ls, inst232_eq);
  CMPX #(.size(10)) inst245 (.A(X), .B(inst251_data), .ls(inst245_ls), .eq(inst245_eq));  // open: gr
  CMPX #(.size(10)) inst32 (.A(X), .B(inst37_data), .ls(inst32_ls), .eq(inst32_eq));  // open: gr
  CMPX #(.size(10)) inst62 (.A(X), .B(inst67_data), .ls(inst62_ls), .eq(inst62_eq));  // open: gr
  CMPX #(.size(10)) inst76 (.A(X), .B(inst86_data), .ls(inst76_ls), .eq(inst76_eq));  // open: gr
  CMPX #(.size(10)) inst219 (.A(X), .B(inst225_data), .ls(inst219_ls), .eq(inst219_eq));  // open: gr
  or inst221 (x2b20, inst219_ls, inst219_eq);
  CONSTX #(.size(10), .\const (5)) inst238 (.data(inst238_data));
  CONSTX #(.size(10), .\const (800)) inst251 (.data(inst251_data));
  or inst247 (x2b22, inst245_ls, inst245_eq);
  CMPX #(.size(10)) inst20 (.A(X), .B(inst19_data), .ls(inst20_ls), .eq(inst20_eq));  // open: gr
  or inst22 (x2b1, inst20_ls, inst20_eq);
  or inst34 (x2b2, inst32_ls, inst32_eq);
  CMPX #(.size(10)) inst47 (.A(X), .B(inst52_data), .ls(inst47_ls), .eq(inst47_eq));  // open: gr
  or inst49 (x2b3, inst47_ls, inst47_eq);
  CONSTX #(.size(10), .\const (800)) inst67 (.data(inst67_data));
  or inst64 (x2b4, inst62_ls, inst62_eq);
  CONSTX #(.size(10), .\const (775)) inst86 (.data(inst86_data));
  or inst78 (x2b5, inst76_ls, inst76_eq);
  CONSTX #(.size(10), .\const (800)) inst225 (.data(inst225_data));
  CONSTX #(.size(10), .\const (25)) inst19 (.data(inst19_data));
  CONSTX #(.size(10), .\const (250)) inst37 (.data(inst37_data));
  CONSTX #(.size(10), .\const (800)) inst52 (.data(inst52_data));
  and inst241 (bb21, x1b21, x2b21, y1b21, y2b21);
  and inst254 (bb22, x1b22, x2b22, y1b22, y2b22);
  and inst99 (bb5, x1b5, x2b5, y1b5, y2b5);
  and inst228 (bb20, x1b20, x2b20, y1b20, y2b20);
  and inst95 (bb1, x1b1, x2b1, y1b1, y2b1);
  and inst96 (bb2, x1b2, x2b2, y1b2, y2b2);
  and inst97 (bb3, x1b3, x2b3, y1b3, y2b3);
  and inst98 (bb4, x1b4, x2b4, y1b4, y2b4);
  CMPX #(.size(10)) inst229 (.A(Y), .B(inst239_data), .eq(inst229_eq), .gr(inst229_gr));  // open: ls
  CMPX #(.size(10)) inst242 (.A(Y), .B(inst252_data), .eq(inst242_eq), .gr(inst242_gr));  // open: ls
  CMPX #(.size(10)) inst25 (.A(Y), .B(inst38_data), .eq(inst25_eq), .gr(inst25_gr));  // open: ls
  CMPX #(.size(10)) inst58 (.A(Y), .B(inst68_data), .eq(inst58_eq), .gr(inst58_gr));  // open: ls
  CMPX #(.size(10)) inst73 (.A(Y), .B(inst81_data), .eq(inst73_eq), .gr(inst73_gr));  // open: ls
  CMPX #(.size(10)) inst216 (.A(Y), .B(inst226_data), .eq(inst216_eq), .gr(inst216_gr));  // open: ls
  CONSTX #(.size(10), .\const (0)) inst239 (.data(inst239_data));
  or inst235 (y1b21, inst229_eq, inst229_gr);
  CONSTX #(.size(10), .\const (0)) inst252 (.data(inst252_data));
  or inst248 (y1b22, inst242_eq, inst242_gr);
  CMPX #(.size(10)) inst13 (.A(Y), .B(inst14_data), .eq(inst13_eq), .gr(inst13_gr));  // open: ls
  CMPX #(.size(10)) inst43 (.A(Y), .B(inst53_data), .eq(inst43_eq), .gr(inst43_gr));  // open: ls
  CONSTX #(.size(10), .\const (0)) inst68 (.data(inst68_data));
  or inst65 (y1b4, inst58_eq, inst58_gr);
  CONSTX #(.size(10), .\const (0)) inst81 (.data(inst81_data));
  or inst79 (y1b5, inst73_eq, inst73_gr);
  CONSTX #(.size(10), .\const (0)) inst226 (.data(inst226_data));
  or inst222 (y1b20, inst216_eq, inst216_gr);
  CONSTX #(.size(10), .\const (200)) inst14 (.data(inst14_data));
  or inst23 (y1b1, inst13_eq, inst13_gr);
  CONSTX #(.size(10), .\const (575)) inst38 (.data(inst38_data));
  or inst35 (y1b2, inst25_eq, inst25_gr);
  CONSTX #(.size(10), .\const (575)) inst53 (.data(inst53_data));
  or inst50 (y1b3, inst43_eq, inst43_gr);
  CMPX #(.size(10)) inst230 (.A(Y), .B(inst240_data), .ls(inst230_ls), .eq(inst230_eq));  // open: gr
  CMPX #(.size(10)) inst217 (.A(Y), .B(inst227_data), .ls(inst217_ls), .eq(inst217_eq));  // open: gr
  CONSTX #(.size(10), .\const (600)) inst240 (.data(inst240_data));
  or inst233 (y2b21, inst230_ls, inst230_eq);
  CMPX #(.size(10)) inst243 (.A(Y), .B(inst253_data), .ls(inst243_ls), .eq(inst243_eq));  // open: gr
  or inst246 (y2b22, inst243_ls, inst243_eq);
  CMPX #(.size(10)) inst16 (.A(Y), .B(inst15_data), .ls(inst16_ls), .eq(inst16_eq));  // open: gr
  CMPX #(.size(10)) inst26 (.A(Y), .B(inst39_data), .ls(inst26_ls), .eq(inst26_eq));  // open: gr
  or inst33 (y2b2, inst26_ls, inst26_eq);
  CMPX #(.size(10)) inst44 (.A(Y), .B(inst54_data), .ls(inst44_ls), .eq(inst44_eq));  // open: gr
  CMPX #(.size(10)) inst59 (.A(Y), .B(inst69_data), .ls(inst59_ls), .eq(inst59_eq));  // open: gr
  or inst63 (y2b4, inst59_ls, inst59_eq);
  CMPX #(.size(10)) inst74 (.A(Y), .B(inst87_data), .ls(inst74_ls), .eq(inst74_eq));  // open: gr
  or inst77 (y2b5, inst74_ls, inst74_eq);
  CONSTX #(.size(10), .\const (5)) inst227 (.data(inst227_data));
  or inst220 (y2b20, inst217_ls, inst217_eq);
  CONSTX #(.size(10), .\const (600)) inst253 (.data(inst253_data));
  CONSTX #(.size(10), .\const (600)) inst15 (.data(inst15_data));
  or inst21 (y2b1, inst16_ls, inst16_eq);
  CONSTX #(.size(10), .\const (600)) inst39 (.data(inst39_data));
  or inst48 (y2b3, inst44_ls, inst44_eq);
  CONSTX #(.size(10), .\const (100)) inst69 (.data(inst69_data));
  CONSTX #(.size(10), .\const (25)) inst87 (.data(inst87_data));
  CONSTX #(.size(10), .\const (600)) inst54 (.data(inst54_data));
  or inst105 (inst105_out, bb1, bb2, bb3, bb4, bb5, bb6, bb7, bb8, bb9, bb10, bb11, bb12);
  or inst255 (podloga, inst105_out, bb20, bb21, bb22, bb1, bb7, bb8, bb17, bb16, bb15, bb14, bb13);
  CONSTX #(.size(4), .\const (0)) inst11 (.data(inst11_data));
  CONSTX #(.size(4), .\const (15)) inst2 (.data(inst2_data));
  CONSTX #(.size(4), .\const (0)) inst9 (.data(inst9_data));
  CONSTX #(.size(4), .\const (0)) inst (.data(inst_data));
  CONSTX #(.size(4), .\const (0)) inst10 (.data(inst10_data));
  CONSTX #(.size(4), .\const (0)) inst1 (.data(inst1_data));
  or inst7 (jump, superskok, superskok, superskok);
  MP2X #(.size(4)) inst93 (.S(jump), .X0(inst10_data), .X1(inst1_data), .Y(inst93_y));
  MP2X #(.size(4)) inst94 (.S(jump), .X0(inst11_data), .X1(inst2_data), .Y(inst94_y));
  MP2X #(.size(4)) inst92 (.S(jump), .X0(inst9_data), .X1(inst_data), .Y(inst92_y));
  CONSTX #(.size(4), .\const (0)) inst207 (.data(inst207_data));
  CONSTX #(.size(4), .\const (0)) inst206 (.data(inst206_data));
  CONSTX #(.size(4), .\const (15)) inst8 (.data(inst8_data));
  or inst208 (t, teleport1, teleport2);
  MP2X #(.size(4)) inst203 (.S(t), .X0(inst92_y), .X1(inst207_data), .Y(inst203_y));
  MP2X #(.size(4)) inst204 (.S(t), .X0(inst93_y), .X1(inst206_data), .Y(inst204_y));
  MP2X #(.size(4)) inst205 (.S(t), .X0(inst94_y), .X1(inst8_data), .Y(inst205_y));
  CONSTX #(.size(4), .\const (15)) inst6 (.data(inst6_data));
  CONSTX #(.size(4), .\const (15)) inst4 (.data(inst4_data));
  CONSTX #(.size(4), .\const (15)) inst5 (.data(inst5_data));
  MP2X #(.size(4)) inst202 (.S(podloga), .X0(inst205_y), .X1(inst6_data), .Y(B));
  MP2X #(.size(4)) inst200 (.S(podloga), .X0(inst203_y), .X1(inst4_data), .Y(R));
  MP2X #(.size(4)) inst201 (.S(podloga), .X0(inst204_y), .X1(inst5_data), .Y(G));

  // Other names for the same wires on the sheet: j1 = superskok; pod = podloga; t1 = teleport1; t2 = teleport2
endmodule
